# Altium schematic sheet Main.SchDoc
size A4
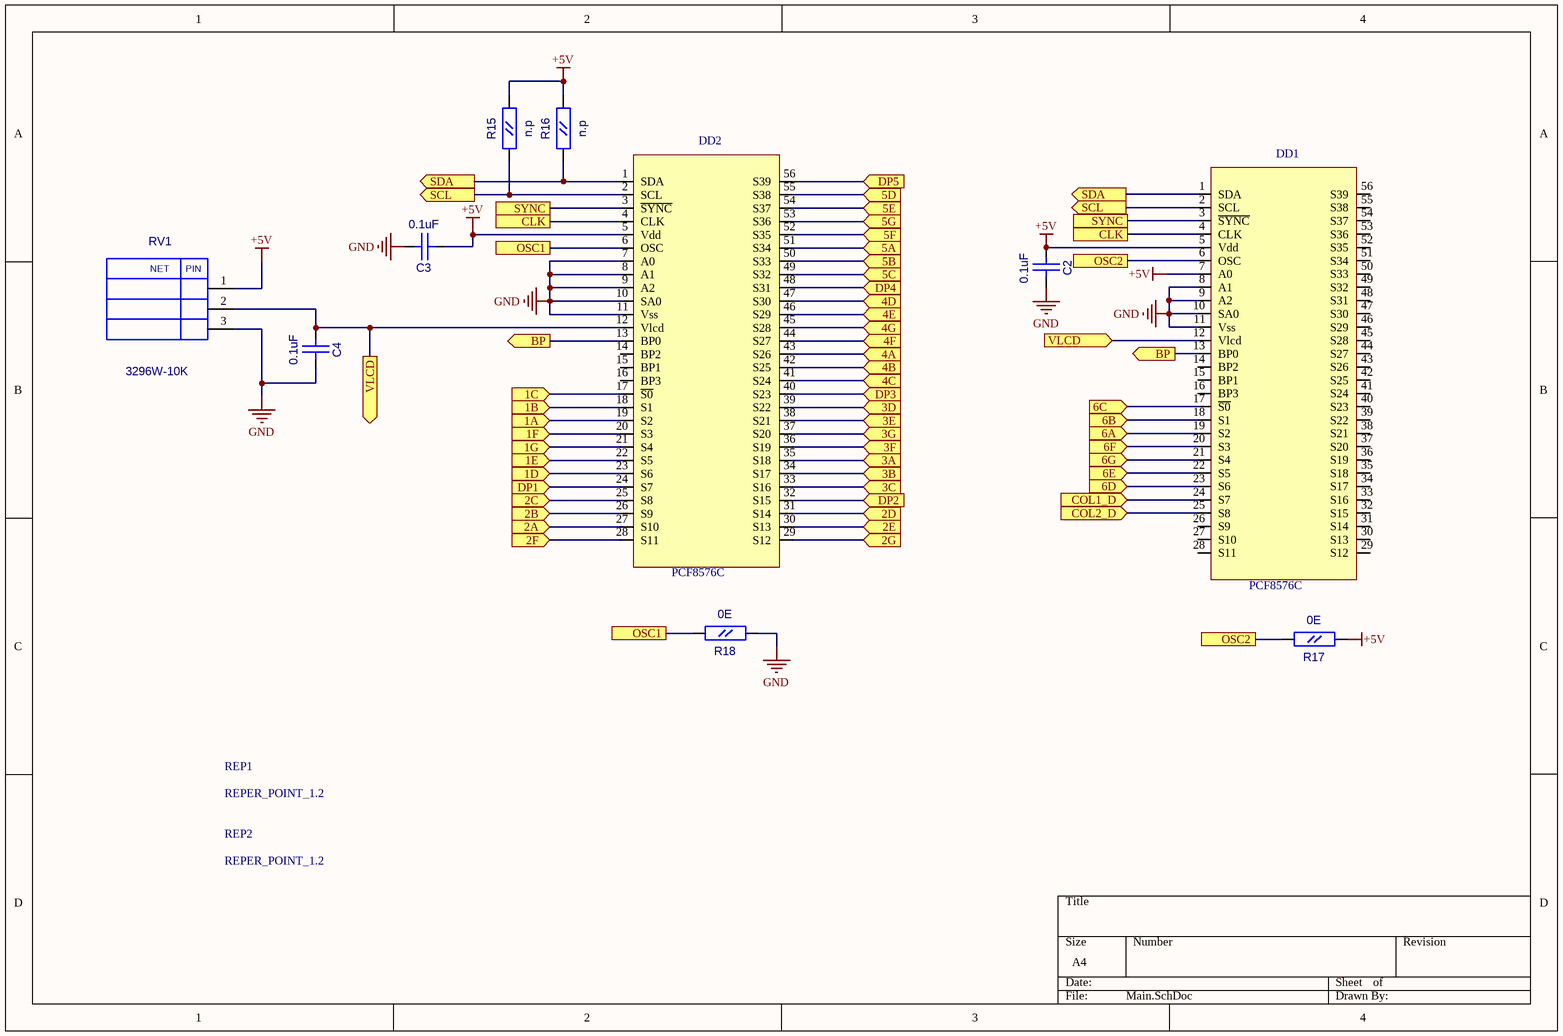
[diagram p0: Main.SchDoc]

## Parts
C2  0.1uF  [CC0603]
C3  0.1uF  [CC0603]
C4  0.1uF  [CC0603]
DD1  PCF8576C  [SOT190-1]
DD2  PCF8576C  [SOT190-1]
R15  n.p  [RC0603]
R16  n.p  [RC0603]
R17  0E  [RC0603]
R18  0E  [RC0603]
REP1  REPER_POINT_1.2  [REPER1.2]
REP2  REPER_POINT_1.2  [REPER1.2]
RV1  3296W-10K  [PLS-03]

## Ports
1A (in), 1B (in), 1C (in), 1D (in), 1E (in), 1F (in), 1G (in), 2A (in), 2B (in), 2C (in), 2D (in), 2E (in), 2F (in), 2G (in), 3A (in), 3B (in), 3C (in), 3D (in), 3E (in), 3F (in), 3G (in), 4A (in), 4B (in), 4C (in), 4D (in), 4E (in), 4F (in), 4G (in), 5A (in), 5B (in), 5C (in), 5D (in), 5E (in), 5F (in), 5G (in), 6A (in), 6B (in), 6C (in), 6D (in), 6E (in), 6F (in), 6G (in), BP (out), CLK, COL1_D (in), COL2_D (in), DP1 (in), DP2 (in), DP3 (in), DP4 (in), DP5 (in), OSC1, OSC2, SCL (out), SDA (out), SYNC, VLCD (in), VLCD (out)

## Nets
+5V: C2.1(A) C3.1(A) DD1.5(Vdd) DD1.7(A0) DD2.5(Vdd) R15.2(B) R16.2(B) R17.1(A) RV1.1
GND: C2.2(B) C3.2(B) C4.2(B) DD1.8(A1) DD1.9(A2) DD1.10(SA0) DD1.11(Vss) DD2.7(A0) DD2.8(A1) DD2.9(A2) DD2.10(SA0) DD2.11(Vss) R18.1(A) RV1.3
1A: DD2.19(S2) ; port 1A
1B: DD2.18(S1) ; port 1B
1C: DD2.17(~{S0}) ; port 1C
1D: DD2.23(S6) ; port 1D
1E: DD2.22(S5) ; port 1E
1F: DD2.20(S3) ; port 1F
1G: DD2.21(S4) ; port 1G
2A: DD2.27(S10) ; port 2A
2B: DD2.26(S9) ; port 2B
2C: DD2.25(S8) ; port 2C
2D: DD2.31(S14) ; port 2D
2E: DD2.30(S13) ; port 2E
2F: DD2.28(S11) ; port 2F
2G: DD2.29(S12) ; port 2G
3A: DD2.35(S18) ; port 3A
3B: DD2.34(S17) ; port 3B
3C: DD2.33(S16) ; port 3C
3D: DD2.39(S22) ; port 3D
3E: DD2.38(S21) ; port 3E
3F: DD2.36(S19) ; port 3F
3G: DD2.37(S20) ; port 3G
4A: DD2.43(S26) ; port 4A
4B: DD2.42(S25) ; port 4B
4C: DD2.41(S24) ; port 4C
4D: DD2.47(S30) ; port 4D
4E: DD2.46(S29) ; port 4E
4F: DD2.44(S27) ; port 4F
4G: DD2.45(S28) ; port 4G
5A: DD2.51(S34) ; port 5A
5B: DD2.50(S33) ; port 5B
5C: DD2.49(S32) ; port 5C
5D: DD2.55(S38) ; port 5D
5E: DD2.54(S37) ; port 5E
5F: DD2.52(S35) ; port 5F
5G: DD2.53(S36) ; port 5G
6A: DD1.19(S2) ; port 6A
6B: DD1.18(S1) ; port 6B
6C: DD1.17(~{S0}) ; port 6C
6D: DD1.23(S6) ; port 6D
6E: DD1.22(S5) ; port 6E
6F: DD1.20(S3) ; port 6F
6G: DD1.21(S4) ; port 6G
BP: DD1.13(BP0) DD2.13(BP0) ; port BP
CLK: DD1.4(CLK) DD2.4(CLK) ; port CLK
COL1_D: DD1.24(S7) ; port COL1_D
COL2_D: DD1.25(S8) ; port COL2_D
DP1: DD2.24(S7) ; port DP1
DP2: DD2.32(S15) ; port DP2
DP3: DD2.40(S23) ; port DP3
DP4: DD2.48(S31) ; port DP4
DP5: DD2.56(S39) ; port DP5
OSC1: DD2.6(OSC) R18.2(B) ; port OSC1
OSC2: DD1.6(OSC) R17.2(B) ; port OSC2
SCL: DD1.2(SCL) DD2.2(SCL) R15.1(A) ; port SCL
SDA: DD1.1(SDA) DD2.1(SDA) R16.1(A) ; port SDA
SYNC: DD1.3(~{SYNC}) DD2.3(~{SYNC}) ; port SYNC
VLCD: C4.1(A) DD1.12(Vlcd) DD2.12(Vlcd) RV1.2 ; port VLCD

Not connected (* = marked no-connect by the designer): DD1 14(BP2) 15(BP1) 16(BP3) 26(S9) 27(S10) 28(S11) 29(S12) 30(S13) 31(S14) 32(S15) 33(S16) 34(S17) 35(S18) 36(S19) 37(S20) 38(S21) 39(S22) 40(S23) 41(S24) 42(S25) 43(S26) 44(S27) 45(S28) 46(S29) 47(S30) 48(S31) 49(S32) 50(S33) 51(S34) 52(S35) 53(S36) 54(S37) 55(S38) 56(S39); DD2 14(BP2) 15(BP1) 16(BP3); REP1 1; REP2 1

## Notes on the sheet
- (in symbol PLS03) NET; PIN

## Library data of the parts
C2-C4 = CC0603: Value: 0.1uF
DD1 DD2 = PCF8576: LCD Controller; Value: PCF8576C
R15-R18 = RC0603
  R15 R16: Value: n.p
  R17 R18: Value: 0E
REP1 REP2 = REPER1.2: Value: REPER_POINT_1.2
RV1 = PLS03: Value: *